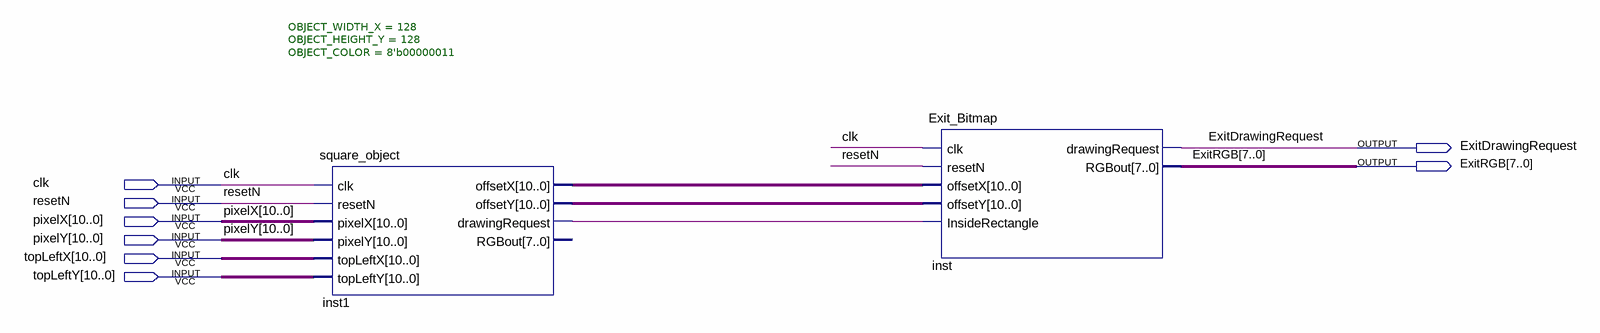
[diagram p0: schematic sheet]
// Quartus schematic Exit_Display.bdf as structural Verilog: 2 symbols, 8 pins
module Exit_Display (
  input  clk,
  input  resetN,
  input  [10:0] pixelX,
  input  [10:0] pixelY,
  input  [10:0] topLeftX,
  input  [10:0] topLeftY,
  output ExitDrawingRequest,
  output [7:0] ExitRGB
);

  wire inst1_drawingrequest;
  wire [10:0] inst1_offsetx, inst1_offsety;

  square_object #(.OBJECT_WIDTH_X(128), .OBJECT_HEIGHT_Y(128), .OBJECT_COLOR(8'b00000011)) inst1 (
    .clk(clk), .resetN(resetN), .pixelX(pixelX), .pixelY(pixelY), .topLeftX(topLeftX), .topLeftY(topLeftY),
    .offsetX(inst1_offsetx), .offsetY(inst1_offsety), .drawingRequest(inst1_drawingrequest));  // open: RGBout
  Exit_Bitmap inst (
    .clk(clk), .resetN(resetN), .offsetX(inst1_offsetx), .offsetY(inst1_offsety),
    .InsideRectangle(inst1_drawingrequest), .drawingRequest(ExitDrawingRequest), .RGBout(ExitRGB));
endmodule
